# EAGLE design isobot-bt (EAGLE 5.08)
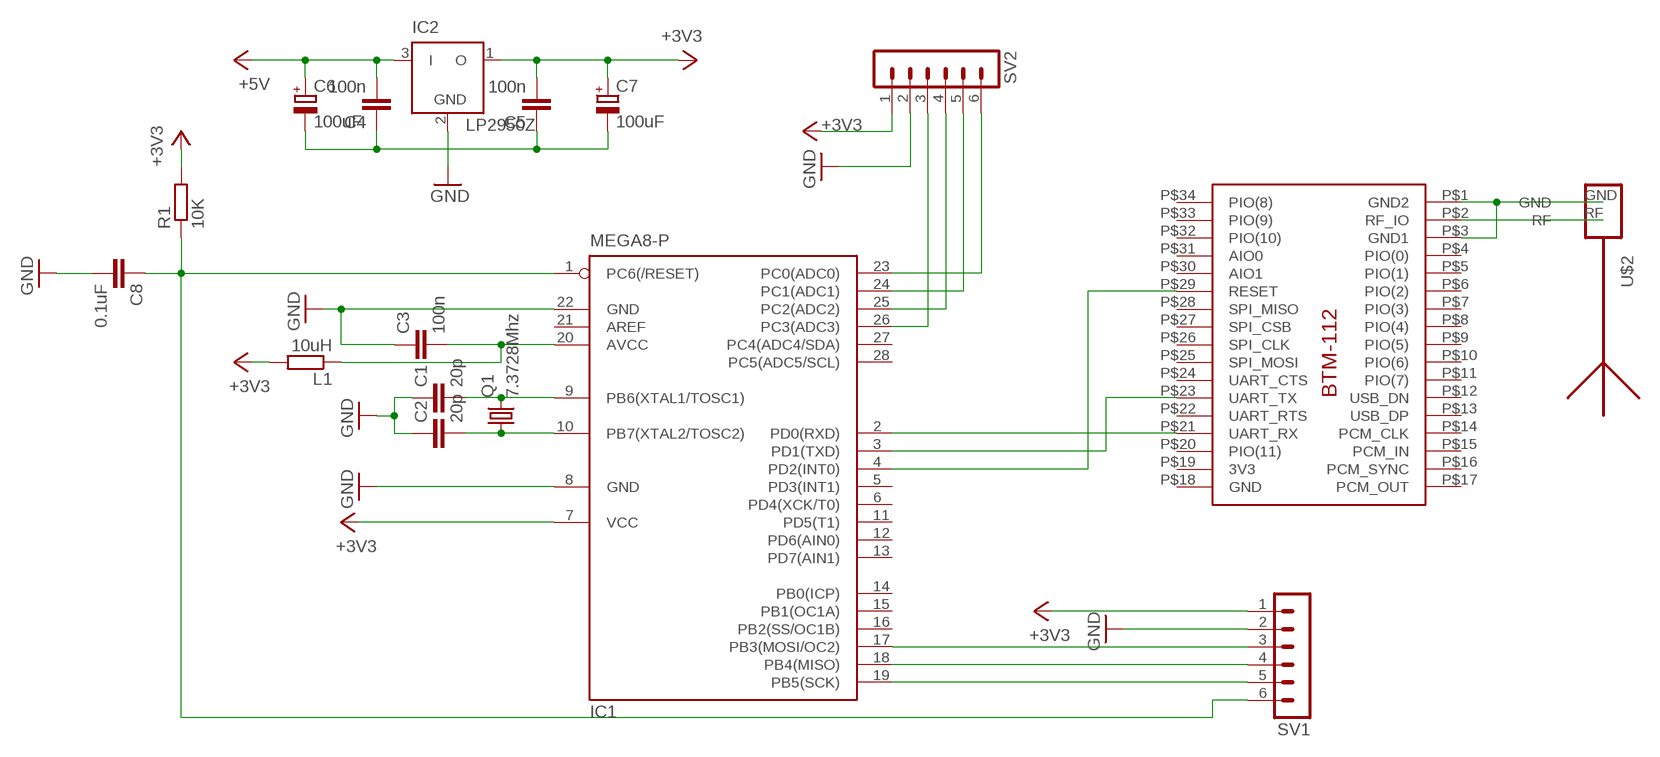
[diagram p0: schematic, sheet 1]

## Parts
C1  20p  C-EU025-025X050  [C025-025X050]
C2  20p  C-EU025-025X050  [C025-025X050]
C3  100n  C-EU025-025X050  [C025-025X050]
C4  100n  C-EU025-025X050  [C025-025X050]
C5  100n  C-EU025-025X050  [C025-025X050]
C6  100uF  CPOL-EUE2,5-6E  [E2,5-6E]
C7  100uF  CPOL-EUE2,5-6E  [E2,5-6E]
C8  0.1uF  C-EU025-025X050  [C025-025X050]
IC1  MEGA8-P  [DIL28-3]
IC2  LP2950Z  [TO92]
L1  10uH  R-EU_0207/15  [0207/15]
Q1  7.3728Mhz  CRYSTALHC49S  [HC49/S]
R1  10K  R-EU_0207/10  [0207/10]
SV1  MA06-1  [MA06-1]
SV2  MA06-1  [MA06-1]
U$1  BTM-112  [BTM-112]
U$2  ANTENNA_1LEFT  [SWRA117D_LEFT]

## Nets
+3V3: C5.2 C7.+ IC1.7(VCC) IC2.1(O) L1.2 R1.2 SV1.1 SV2.1
+5V: C4.2 C6.+ IC2.3(I)
GND: C1.1 C2.1 C3.1 C4.1 C5.1 C6.- C7.- C8.2 IC1.8(GND) IC1.22(GND) IC2.2(GND) SV1.2 SV2.2
N$1: U$1.P$2(RF_IO) U$2.RF
N$2: U$1.P$1(GND2) U$1.P$3(GND1) U$2.GND
N$3: IC1.2(PD0(RXD)) U$1.P$21(UART_RX)
N$4: IC1.3(PD1(TXD)) U$1.P$23(UART_TX)
N$5: IC1.4(PD2(INT0)) U$1.P$29(RESET)
N$6: C1.2 IC1.9(PB6(XTAL1/TOSC1)) Q1.2
N$7: C2.2 IC1.10(PB7(XTAL2/TOSC2)) Q1.1
N$8: C3.2 IC1.20(AVCC) L1.1
N$9: IC1.17(PB3(MOSI/OC2)) SV1.3
N$10: IC1.19(PB5(SCK)) SV1.5
N$11: C8.1 IC1.1(PC6(/RESET)) R1.1 SV1.6
N$12: IC1.18(PB4(MISO)) SV1.4
N$13: IC1.26(PC3(ADC3)) SV2.3
N$14: IC1.25(PC2(ADC2)) SV2.4
N$15: IC1.24(PC1(ADC1)) SV2.5
N$16: IC1.23(PC0(ADC0)) SV2.6
Unconnected: IC1.5(PD3(INT1)) IC1.6(PD4(XCK/T0)) IC1.11(PD5(T1)) IC1.12(PD6(AIN0)) IC1.13(PD7(AIN1)) IC1.14(PB0(ICP)) IC1.15(PB1(OC1A)) IC1.16(PB2(SS/OC1B)) IC1.21(AREF) IC1.27(PC4(ADC4/SDA)) IC1.28(PC5(ADC5/SCL)) U$1.P$4(PIO(0)) U$1.P$5(PIO(1)) U$1.P$6(PIO(2)) U$1.P$7(PIO(3)) U$1.P$8(PIO(4)) U$1.P$9(PIO(5)) U$1.P$10(PIO(6)) U$1.P$11(PIO(7)) U$1.P$12(USB_DN) U$1.P$13(USB_DP) U$1.P$14(PCM_CLK) U$1.P$15(PCM_IN) U$1.P$16(PCM_SYNC) U$1.P$17(PCM_OUT) U$1.P$18(GND) U$1.P$19(3V3) U$1.P$20(PIO(11)) U$1.P$22(UART_RTS) U$1.P$24(UART_CTS) U$1.P$25(SPI_MOSI) U$1.P$26(SPI_CLK) U$1.P$27(SPI_CSB) U$1.P$28(SPI_MISO) U$1.P$30(AIO1) U$1.P$31(AIO0) U$1.P$32(PIO(10)) U$1.P$33(PIO(9)) U$1.P$34(PIO(8))

## Library data of the parts
C1-C5 C8 = rcl:C-EU: CAPACITOR, European symbol
C6 C7 = rcl:CPOL-EU: POLARIZED CAPACITOR, European symbol
IC1 = atmel:MEGA8-P: MICROCONTROLLER 8 Kbytes FLASH, 1 kbytes SRAM, 512 bytes EEPROM, USART, 4-channel 10 bit ADC, 2-channel 8 bit ADC Pin compatible with Atmega48, ATMega88, ATMega168 Source: avr.lbr
IC2 = linear:LP2950: 100 mA, Low Power Low Dropout Voltage Regulator Source: http://www.onsemi.com/pub/Collateral/LP2950-D.PDF
L1 R1 = rcl:R-EU_: RESISTOR, European symbol
Q1 = crystal:CRYSTAL: CRYSTAL
SV1 SV2 = con-lstb:MA06-1: PIN HEADER
U$1 = BTM112:BTM-112
U$2 = ant-planar-1:ANTENNA_1

## Board
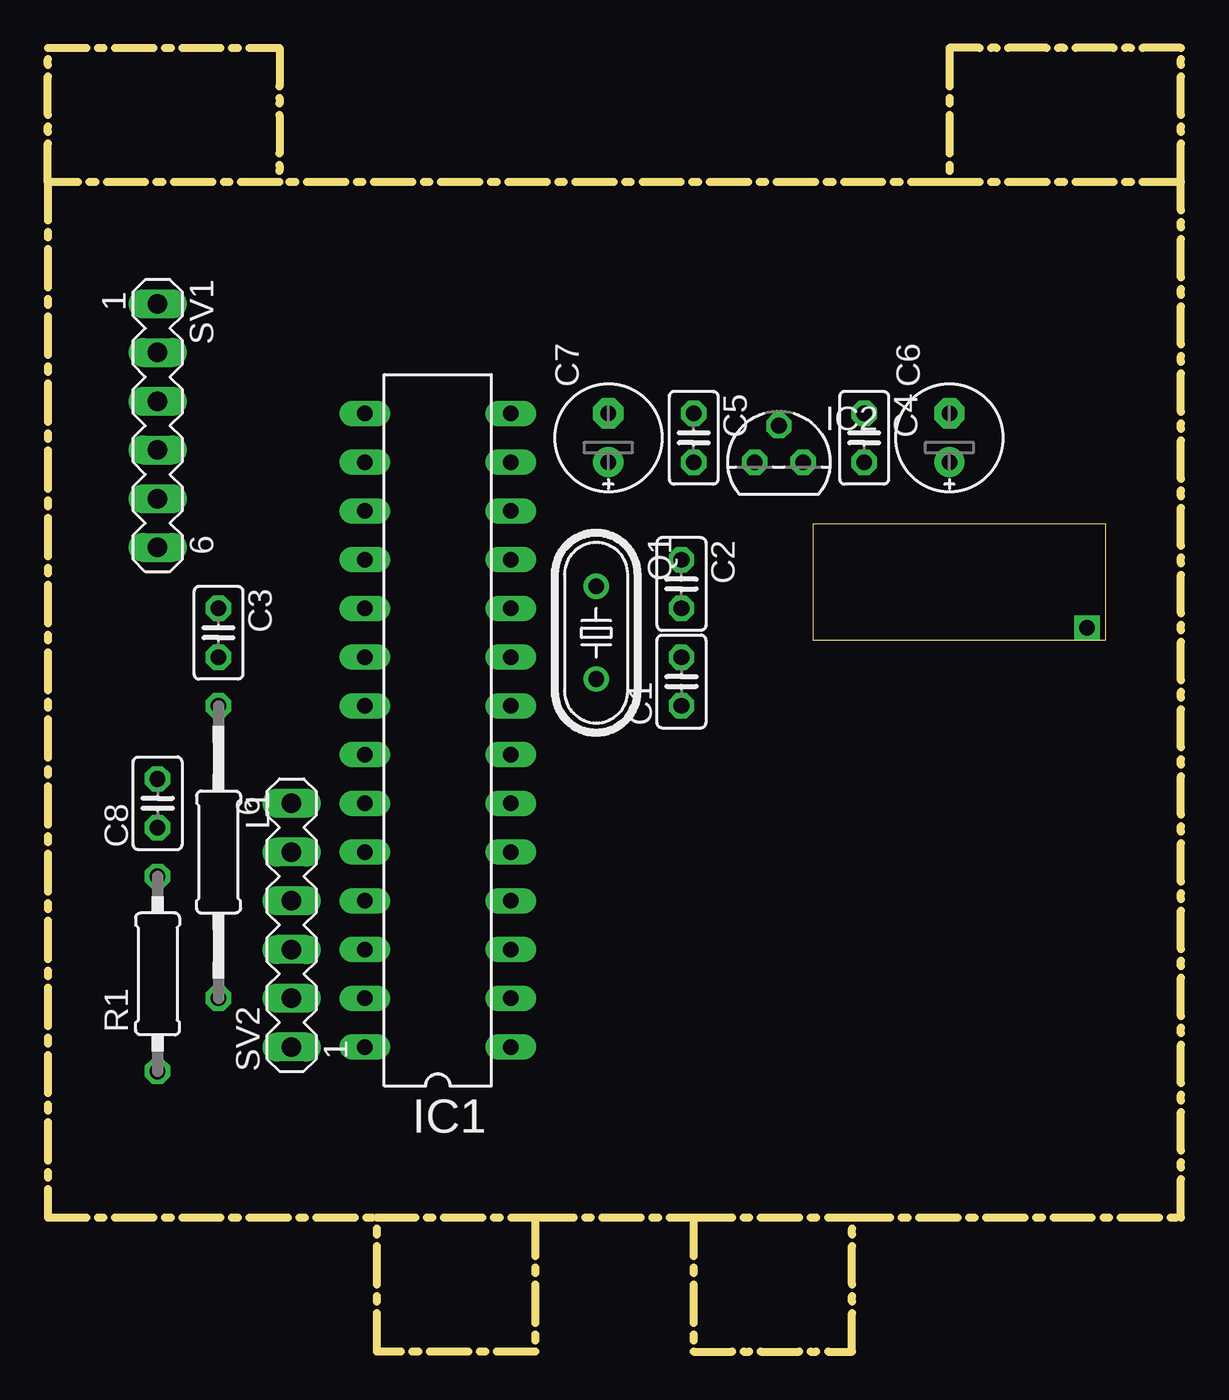
[diagram p1: board, top side]
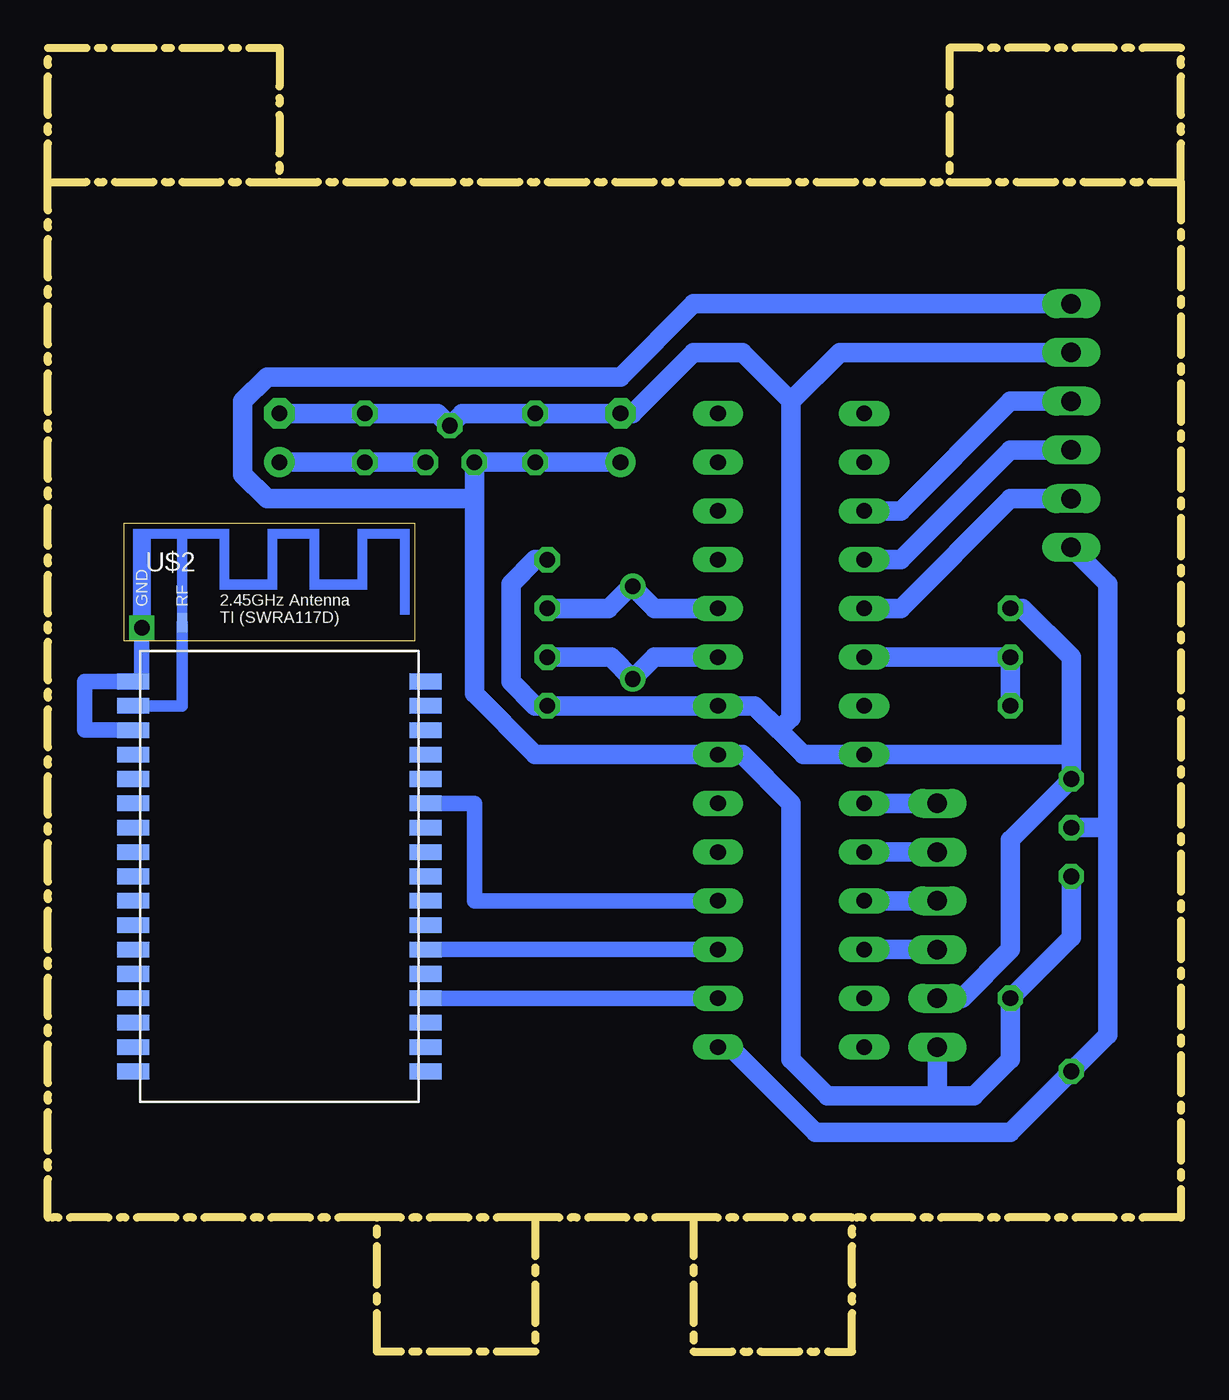
[diagram p2: board, bottom side, seen from below]

Size 59.05 x 67.94 mm. Coordinates in mm from the lower left corner, seen from the top.
Outline: 0,60.96 0,6.98 17.15,6.98
Outline: 17.15,6.98 25.4,6.98
Outline: 25.4,6.98 33.66,6.98
Outline: 33.66,6.98 41.91,6.98
Outline: 41.91,6.98 59.05,6.98 59.05,60.96
Outline: 59.05,60.96 46.99,60.96
Outline: 46.99,60.96 12.06,60.96
Outline: 12.06,60.96 0,60.96
Outline: 0,60.96 0,67.94 12.06,67.94 12.06,60.96
Outline: 59.05,60.96 59.05,67.94 46.99,67.94 46.99,60.96
Outline: 25.4,6.98 25.4,0 17.15,0 17.15,6.98
Outline: 33.66,6.98 33.66,0 41.91,0 41.91,6.98
Copper layers (1*16): Top 0.035mm / dielectric 1.5mm / Bottom 0.035mm
Design rules "default": minimum track width 10mil, minimum drill 24mil, track to track 8mil, track to pad 8mil, pad to pad 8mil, via to via 8mil, smd to smd 8mil, copper to edge 40mil, drill to drill 8mil, minimum pad ring 10mil, minimum via ring 8mil, stop-mask expansion 4mil, vias tented up to drill 0mil, thermal gap 10mil

### Footprints (pad centres in the part's own frame; a part is rotated, then mirrored left to right if it is on the bottom)
C025-025X050 = drill 0.813 octagon: 1 -1.27,0; 2 1.27,0
E2,5-6E = drill 0.813 pad 1.575 round: + -1.27,0 | drill 0.813 pad 1.575 octagon: - 1.27,0
DIL28-3 = drill 0.813 long: 1 -16.51,-3.81; 2 -13.97,-3.81; 3 -11.43,-3.81; 4 -8.89,-3.81; 5 -6.35,-3.81; 6 -3.81,-3.81; 7 -1.27,-3.81; 8 1.27,-3.81; 9 3.81,-3.81; 10 6.35,-3.81; 11 8.89,-3.81; 12 11.43,-3.81; 13 13.97,-3.81; 14 16.51,-3.81; 15 16.51,3.81; 16 13.97,3.81; 17 11.43,3.81; 18 8.89,3.81; 19 6.35,3.81; 20 3.81,3.81; 21 1.27,3.81; 22 -1.27,3.81; 23 -3.81,3.81; 24 -6.35,3.81; 25 -8.89,3.81; 26 -11.43,3.81; 27 -13.97,3.81; 28 -16.51,3.81
TO92 = drill 0.813 octagon: 1 -1.27,0; 2 0,1.905; 3 1.27,0
0207/15 = drill 0.813 octagon: 1 -7.62,0; 2 7.62,0
HC49/S = drill 0.813 round: 1 -2.413,0; 2 2.413,0
0207/10 = drill 0.813 octagon: 1 -5.08,0; 2 5.08,0
MA06-1 = drill 1.016 long: 1 -6.35,0; 2 -3.81,0; 3 -1.27,0; 4 1.27,0; 5 3.81,0; 6 6.35,0
BTM-112 = smd 1.676 x 0.813: P$1 -7.62,10.16; P$2 -7.62,8.89; P$3 -7.62,7.62; P$4 -7.62,6.35; P$5 -7.62,5.08; P$6 -7.62,3.81; P$7 -7.62,2.54; P$8 -7.62,1.27; P$9 -7.62,0; P$10 -7.62,-1.27; P$11 -7.62,-2.54; P$12 -7.62,-3.81; P$13 -7.62,-5.08; P$14 -7.62,-6.35; P$15 -7.62,-7.62; P$16 -7.62,-8.89; P$17 -7.62,-10.16; P$18 7.62,-10.16; P$19 7.62,-8.89; P$20 7.62,-7.62; P$21 7.62,-6.35; P$22 7.62,-5.08; P$23 7.62,-3.81; P$24 7.62,-2.54; P$25 7.62,-1.27; P$26 7.62,0; P$27 7.62,1.27; P$28 7.62,2.54; P$29 7.62,3.81; P$30 7.62,5.08; P$31 7.62,6.35; P$32 7.62,7.62; P$33 7.62,8.89; P$34 7.62,10.16
SWRA117D_LEFT = drill 0.8 square: GND 0.45,0.25 | smd 0.508 x 1.016: RF 2.55,0.51

### Placement (x,y rotation side)
C1  33.02,34.92 90 top
C2  33.02,40.01 270 top
C3  8.89,37.47 270 top
C4  42.55,47.62 270 top
C5  33.66,47.62 270 top
C6  46.99,47.62 90 top
C7  29.21,47.62 90 top
C8  5.72,28.57 90 top
IC1  20.32,32.38 90 top
IC2  38.1,46.36 0 top
L1  8.89,26.04 270 top
Q1  28.57,37.47 270 top
R1  5.72,19.69 90 top
SV1  5.72,48.26 270 top
SV2  12.7,22.23 90 top
U$1  46.99,24.77 0 bottom
U$2  54.61,37.47 0 bottom

### Tracks (layer width: path | path; a pad name or v marks a point on that pad's centre or on a via)
+3V3
  Bottom 1.016: 12.7,13.34 10.79,13.34 8.89,15.24 L1.2 5.72,21.59 R1.2 | 12.7,13.34 18.41,13.34 20.32,15.24 20.32,28.57 22.86,31.12 IC1.7 33.66,31.12 36.83,34.29 36.83,44.45 | C7.+ C5.2 IC2.1 36.83,44.45 | SV1.1 25.4,54.61 29.21,50.8 47.62,50.8 48.89,49.53 48.89,45.72 47.62,44.45 36.83,44.45 | 12.7,13.34 SV2.1
+5V
  Bottom 1.016: IC2.3 C4.2 C6.+
GND
  Bottom 1.016: C2.1 33.66,41.28 34.92,40.01 34.92,34.92 33.66,33.66 C1.1 IC1.8 22.23,33.66 20.95,32.38 | 20.95,32.38 19.69,31.12 IC1.22 5.72,31.12 | C6.- C4.1 38.73,48.89 IC2.2 37.46,48.89 C5.1 | C5.1 C7.- | C5.1 28.57,48.89 25.4,52.07 22.86,52.07 20.32,49.53 | 20.32,49.53 20.32,33.02 20.95,32.38 | SV1.2 17.78,52.07 20.32,49.53 | SV2.2 11.43,18.41 8.89,20.96 8.89,26.67 C8.2 5.72,31.12 | C3.1 8.26,38.73 5.72,36.2 5.72,31.12
N$1
  Bottom 0.61: U$1.P$2 52.06,33.66 U$2.RF
N$2
  Bottom 0.813: U$2.GND 54.16,34.92 U$1.P$1 57.15,34.92 57.15,32.38 U$1.P$3
N$3
  Bottom 0.813: IC1.2 U$1.P$21
N$4
  Bottom 0.813: IC1.3 U$1.P$23
N$5
  Bottom 0.813: U$1.P$29 36.83,28.57 36.83,23.5 IC1.4
N$6
  Bottom 1.016: IC1.9 27.43,36.2 Q1.2 29.72,36.2 C1.2
N$7
  Bottom 1.016: IC1.10 27.43,38.73 Q1.1 28.7,39.88 29.84,38.73 C2.2
N$8
  Bottom 1.016: IC1.20 C3.2 L1.1
N$9
  Bottom 1.016: IC1.17 14.6,43.81 8.89,49.53 SV1.3
N$10
  Bottom 1.016: IC1.19 14.6,38.73 8.89,44.45 SV1.5
N$11
  Bottom 1.016: IC1.1 23.49,15.88 19.05,11.43 8.89,11.43 R1.1 3.81,16.51 3.81,27.3 | 3.81,27.3 3.81,40.01 SV1.6 | 3.81,27.3 C8.1
N$12
  Bottom 1.016: IC1.18 14.6,41.28 8.89,46.99 SV1.4
N$13
  Bottom 1.016: IC1.26 SV2.3
N$14
  Bottom 1.016: IC1.25 SV2.4
N$15
  Bottom 1.016: IC1.24 SV2.5
N$16
  Bottom 1.016: IC1.23 SV2.6